# EAGLE design phmeter (EAGLE 8.4.3)
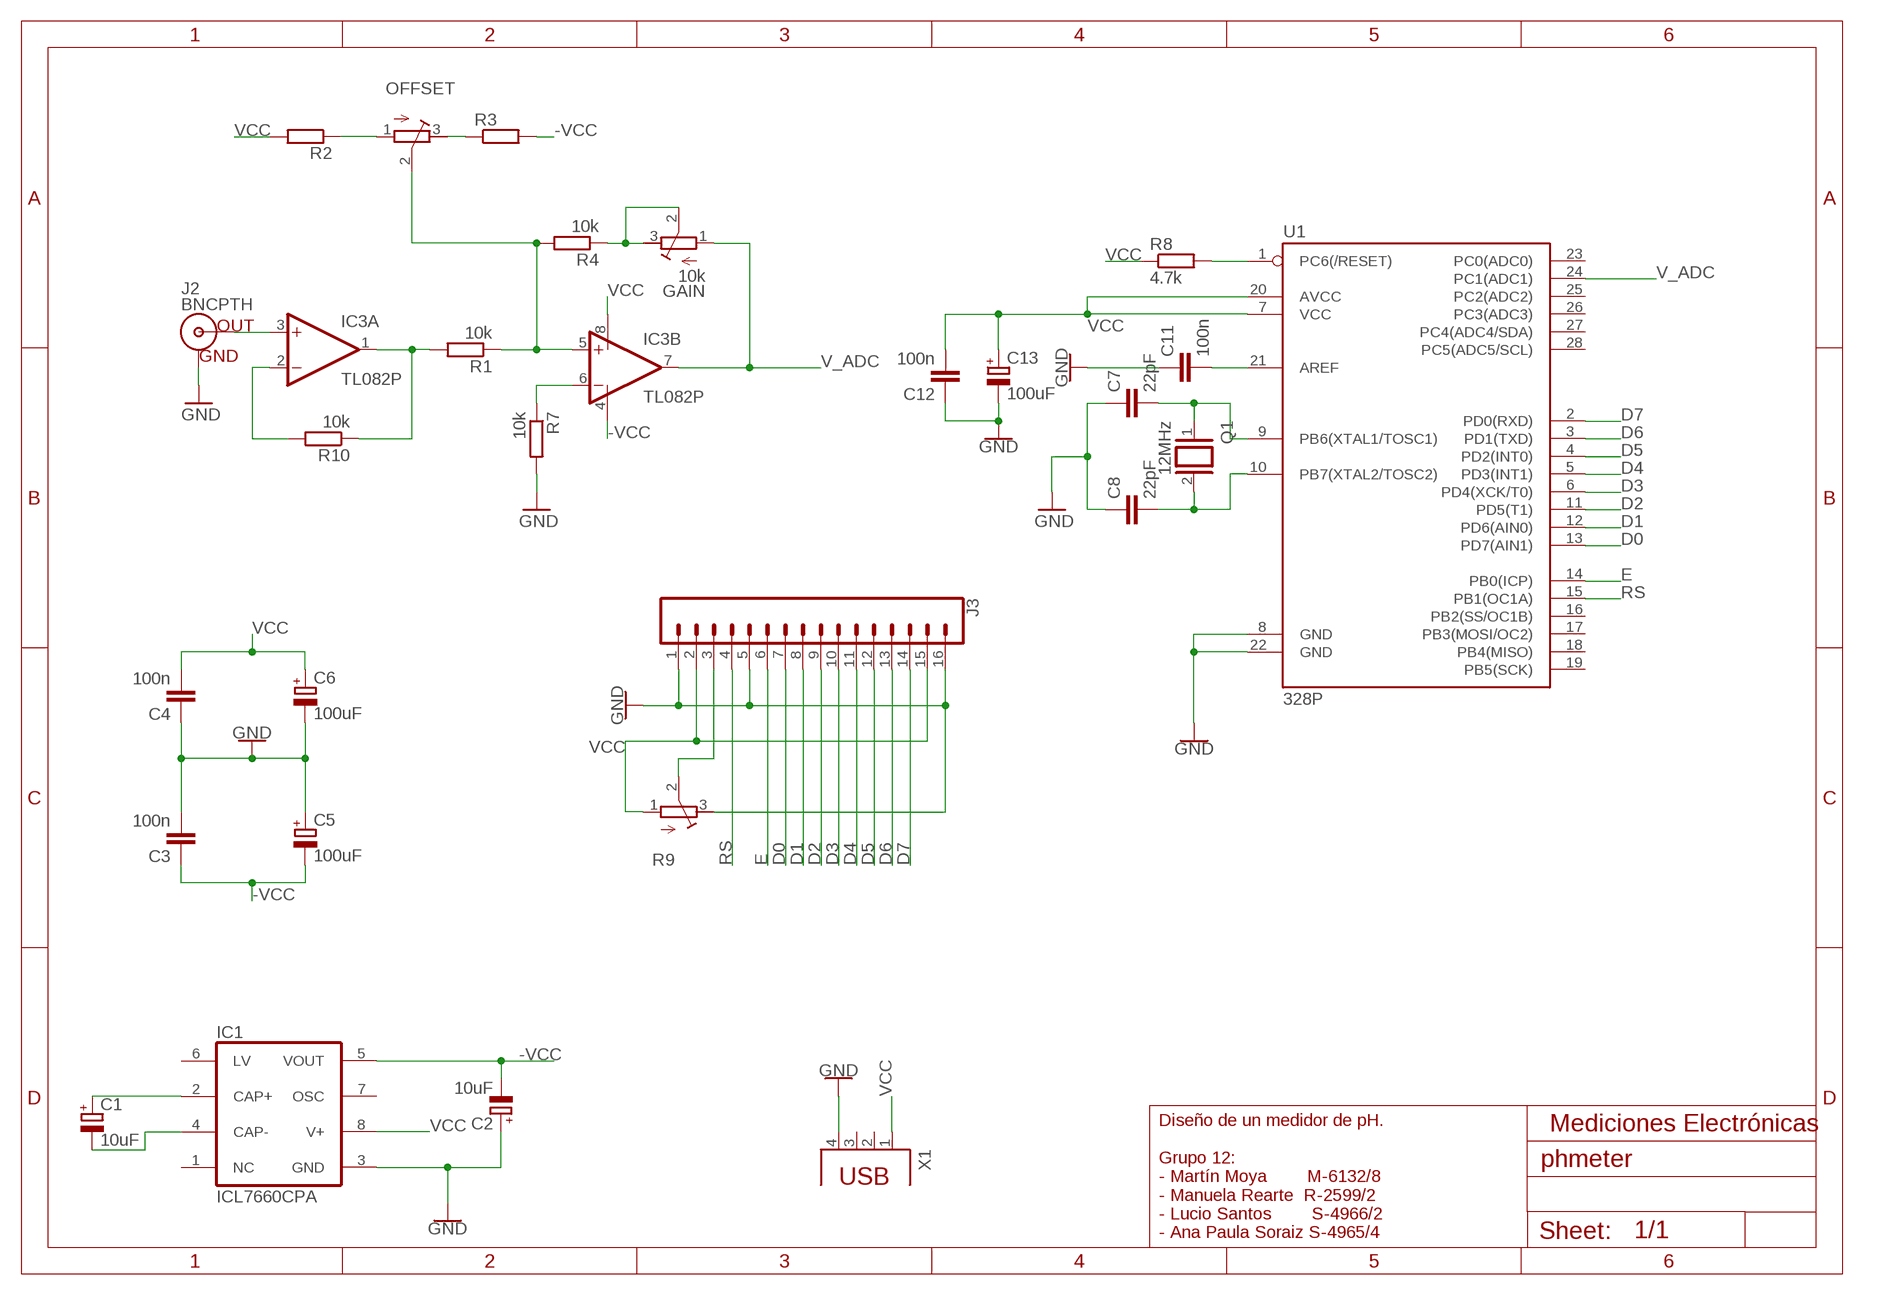
[diagram p0: schematic, sheet 1]

## Parts
C1  10uF  CPOL-EUE1.8-4  [E1,8-4]
C2  10uF  CPOL-EUE1.8-4  [E1,8-4]
C3  100n  C-EU025-024X044  [C025-024X044]
C4  100n  C-EU025-024X044  [C025-024X044]
C5  100uF  CPOL-EUE1.8-4  [E1,8-4]
C6  100uF  CPOL-EUE1.8-4  [E1,8-4]
C7  22pF  C-EU025-024X044  [C025-024X044]
C8  22pF  C-EU025-024X044  [C025-024X044]
C11  100n  C-EU025-024X044  [C025-024X044]
C12  100n  C-EU025-024X044  [C025-024X044]
C13  100uF  CPOL-EUE1.8-4  [E1,8-4]
GAIN  10k  R-TRIMM64W  [RTRIM64W]
IC1  ICL7660CPA  [DIL08]
IC3  TL082P  [DIL08]
J2  BNCPTH  [BNC]
J3  CONN_16  [1X16]
OFFSET  R-TRIMM64W  [RTRIM64W]
Q1  12MHz  XTAL/S  [QS]
R1  10k  R-EU_0207/10  [0207/10]
R2  R-EU_0207/10  [0207/10]
R3  R-EU_0207/10  [0207/10]
R4  10k  R-EU_0207/10  [0207/10]
R7  10k  R-EU_0207/10  [0207/10]
R8  4.7k  R-EU_0207/10  [0207/10]
R9  R-TRIMM64W  [RTRIM64W]
R10  10k  R-EU_0207/10  [0207/10]
U1  328P  ATMEGA328P_PDIP  [DIP28]
X1  PN61729  [PN61729]

## Nets
-VCC: C2.- C3.1 C5.- IC1.5(VOUT) IC3.4(P:V-) R3.2
D0: J3.7 U1.13(PD7(AIN1))
D1: J3.8 U1.12(PD6(AIN0))
D2: J3.9 U1.11(PD5(T1))
D3: J3.10 U1.6(PD4(XCK/T0))
D4: J3.11 U1.5(PD3(INT1))
D5: J3.12 U1.4(PD2(INT0))
D6: J3.13 U1.3(PD1(TXD))
D7: J3.14 U1.2(PD0(RXD))
E: J3.6 U1.14(PB0(ICP))
GND: C2.+ C3.2 C4.1 C5.+ C6.- C7.1 C8.1 C11.1 C12.1 C13.- IC1.3(GND) J2.GND J3.1 J3.5 J3.16 R7.2 R9.3(E) U1.8(GND) U1.22(GND) X1.4
N$1: IC3.1(A:OUT) R1.2 R10.1
N$2: C1.+ IC1.2(CAP+)
N$3: GAIN.2(S) GAIN.3(E) R4.1
N$4: IC3.6(B:-IN) R7.1
N$5: C1.- IC1.4(CAP-)
N$6: OFFSET.3(E) R3.1
N$7: OFFSET.1(A) R2.1
N$8: C7.2 Q1.1 U1.9(PB6(XTAL1/TOSC1))
N$9: C8.2 Q1.2 U1.10(PB7(XTAL2/TOSC2))
N$10: J3.3 R9.2(S)
N$11: C11.2 U1.21(AREF)
N$12: R8.2 U1.1(PC6(/RESET))
N$22: IC3.3(A:+IN) J2.S(OUT)
N$23: IC3.2(A:-IN) R10.2
RS: J3.4 U1.15(PB1(OC1A))
V_ADC: GAIN.1(A) IC3.7(B:OUT) U1.24(PC1(ADC1))
V_OFFSET: IC3.5(B:+IN) OFFSET.2(S) R1.1 R4.2
VCC: C4.2 C6.+ C12.2 C13.+ IC1.8(V+) IC3.8(P:V+) J3.2 J3.15 R2.2 R8.1 R9.1(A) U1.7(VCC) U1.20(AVCC) X1.1
Unconnected: IC1.1(NC) IC1.6(LV) IC1.7(OSC) U1.16(PB2(SS/OC1B)) U1.17(PB3(MOSI/OC2)) U1.18(PB4(MISO)) U1.19(PB5(SCK)) U1.23(PC0(ADC0)) U1.25(PC2(ADC2)) U1.26(PC3(ADC3)) U1.27(PC4(ADC4/SDA)) U1.28(PC5(ADC5/SCL)) X1.2 X1.3

## Notes on the sheet
- Mediciones Electrónicas
- Diseño de un medidor de pH.
  
  Grupo 12:
  - Martín Moya        M-6132/8
  - Manuela Rearte  R-2599/2
  - Lucio Santos        S-4966/2
  - Ana Paula Soraiz S-4965/4

## Library data of the parts
C1 C2 C5 C6 C13 = rcl:CPOL-EU: POLARIZED CAPACITOR, European symbol
C3 C4 C7 C8 C11 C12 = resistor:C-EU: CAPACITOR, European symbol
GAIN OFFSET R9 = rcl:R-TRIMM: Trimm resistor
IC1 = maxim:ICL7660CPA: VOLTAGE CONVERTER; MF: INTERSIL; MPN: ICL7660CPA; OC_FARNELL: 1018170; OC_NEWARK: 06F7441
IC3 = linear:TL082: OP AMP Data sheet <http://www.ti.com/lit/ds/symlink/tl084a . pdf>; DATA_SHEET: <a href="http://www.ti.com/lit/ds/symlink/tl084a.pdf"> Data sheet </a>
J2 = SparkFun-Connectors:BNC: BNC Right Angle Connector Mouser Part# 5227161 SparkFun Products: BNC Connector - Right Angle <https://www.sparkfun.com/products/10550>; PROD_ID: LPA-12729; SF_ID: PRT-10550
J3 = SparkFun-Connectors:CONN_16: Multi connection point. Often used as Generic Header-pin footprint for 0.1 inch spaced/style header connections On any of the 0.1 inch spaced packages, you can populate with these: Break Away Headers - Straight <https://www.sparkfun.com/products/116> (PRT-00116) Break Away Male Headers - Right Angle <https://www.sparkfun.com/products/553> (PRT-00553) Female Headers <https://www.sparkfun.com/products/115> (PRT-00115) Break Away Headers - Machine Pin <https://www.sparkfun.com/products/117> (PRT-00117) Break Away Female Headers - Swiss Machine Pin <https://www.sparkfun.com/products/743> (PRT-00743) For SCREWTERMINALS and SPRING TERMINALS visit here: Screw Terimnals on SparkFun.com <https://www.sparkfun.com/search/results?term=Screw+Terminals> (5mm/3.5mm/2.54mm spacing) This device is also useful as a general connection point to wire up your design to another part of your project. Our various solder wires solder well into these plated through hole pads. Hook-Up Wire - Assortment (Stranded, 22 AWG) <https://www.sparkfun.com/products/11375> (PRT-11375) Hook-Up Wire - Assortment (Solid Core, 22 AWG) <https://www.sparkfun.com/products/11367> (PRT-11367) View the entire wire category on our website here <https://www.sparkfun.com/categories/141> Special notes: Molex polarized connector foot print use with SKU : PRT-08231 with associated crimp pins and housings. 1MM SMD Version SKU: PRT-10208 NOTES ON THE VARIANTS LOCK and LOCK_LONGPADS... This footprint was designed to help hold the alignment of a through-hole component (i.e. 6-pin header) while soldering it into place. You may notice that each hole has been shifted either up or down by 0.005 of an inch from it's more standard position (which is a perfectly straight line). This slight alteration caused the pins (the squares in the middle) to touch the edges of the holes. Because they are alternating, it causes a "brace" to hold the component in place. 0.005 has proven to be the perfect amount of "off-center" position when using our standard breakaway headers. Although looks a little odd when you look at the bare footprint, once you have a header in there, the alteration is very hard to notice. Also,if you push a header all the way into place, it is covered up entirely on the bottom side.
Q1 = special:XTAL/S: CRYSTAL
R1-R4 R7 R8 R10 = rcl:R-EU_: RESISTOR, European symbol
U1 = SparkFun-IC-Microcontroller:ATMEGA328P_PDIP: Atmel 328P Through hole ATMEGA328P uC used in the Arduino 32kb flash, 1k EEPROM, 2k SRAM Datasheet <http://www.sparkfun.com/datasheets/Components/SMD/ATMega328.pdf> SparkFun Products Storefront component: AVR 28 Pin 20MHz 32K 6A/D - ATMega328P <https://www.sparkfun.com/products/9061> (COM-09061) SparkFun Simon Says - Through-Hole Soldering Kit <https://www.sparkfun.com/products/10547> (KIT-10547) SparkFun Learn to Solder - Simon Says <https://www.sparkfun.com/products/13708> (KIT-13708) SparkFun BigTime Watch Kit <https://www.sparkfun.com/products/11734> (KIT-11734) SparkFun ClockIt <https://www.sparkfun.com/products/10930> (KIT-10930) SparkFun Serial Enabled LCD Kit <https://www.sparkfun.com/products/10097> (LCD-10097) SparkFun Simon Tilts - Through Hole Soldering Kit <https://www.sparkfun.com/products/12634> (KIT-12634) SparkFun Frequency Counter Kit <https://www.sparkfun.com/products/10140> (KIT-10140) FabFM Radio Kit <https://www.sparkfun.com/products/11043> (KIT-11043) SparkFun Binary Blaster Kit <https://www.sparkfun.com/products/12037> (KIT-12037) SparkFun Metro-Gnome <https://www.sparkfun.com/products/9236> (KIT-09236) ATmega328 with Arduino Optiboot (Uno) <https://www.sparkfun.com/products/10524> (DEV-10524); PROD_ID: IC-09136
X1 = con-berg:PN61729: BERG USB connector; OC_FARNELL: unknown; OC_NEWARK: unknown

## Module -VC
Ports: 

### Library data of the parts

## Board
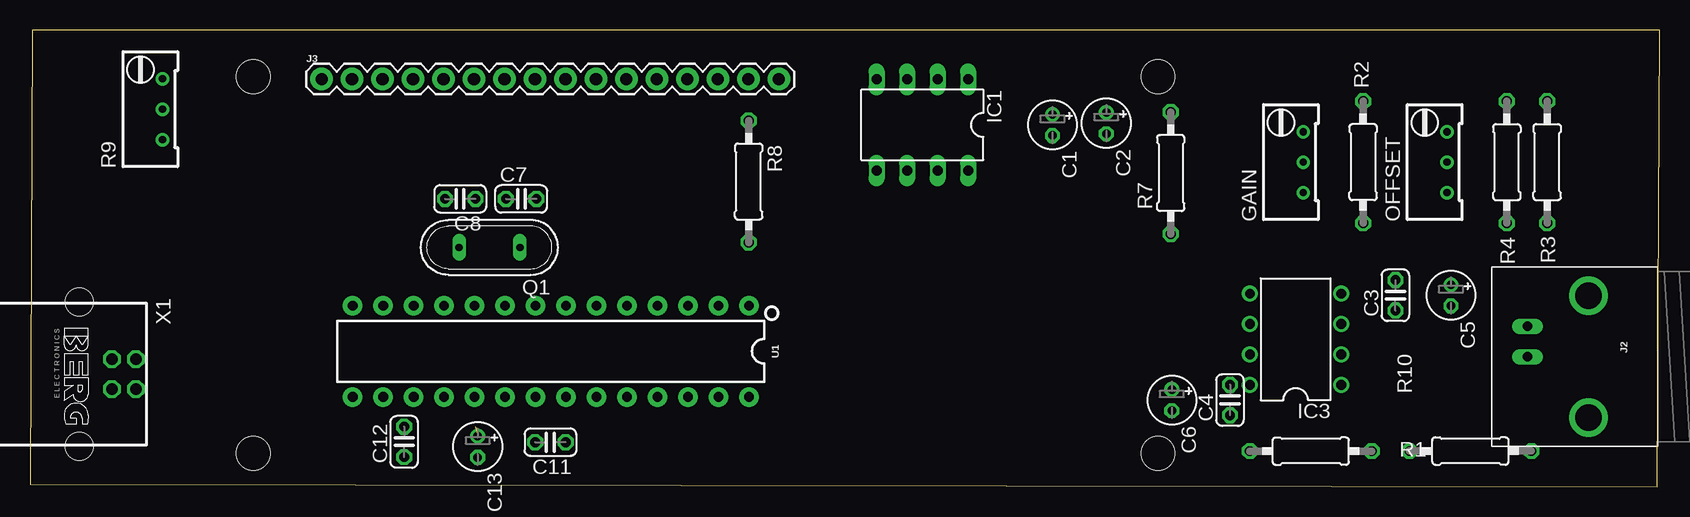
[diagram p1: board, top side]
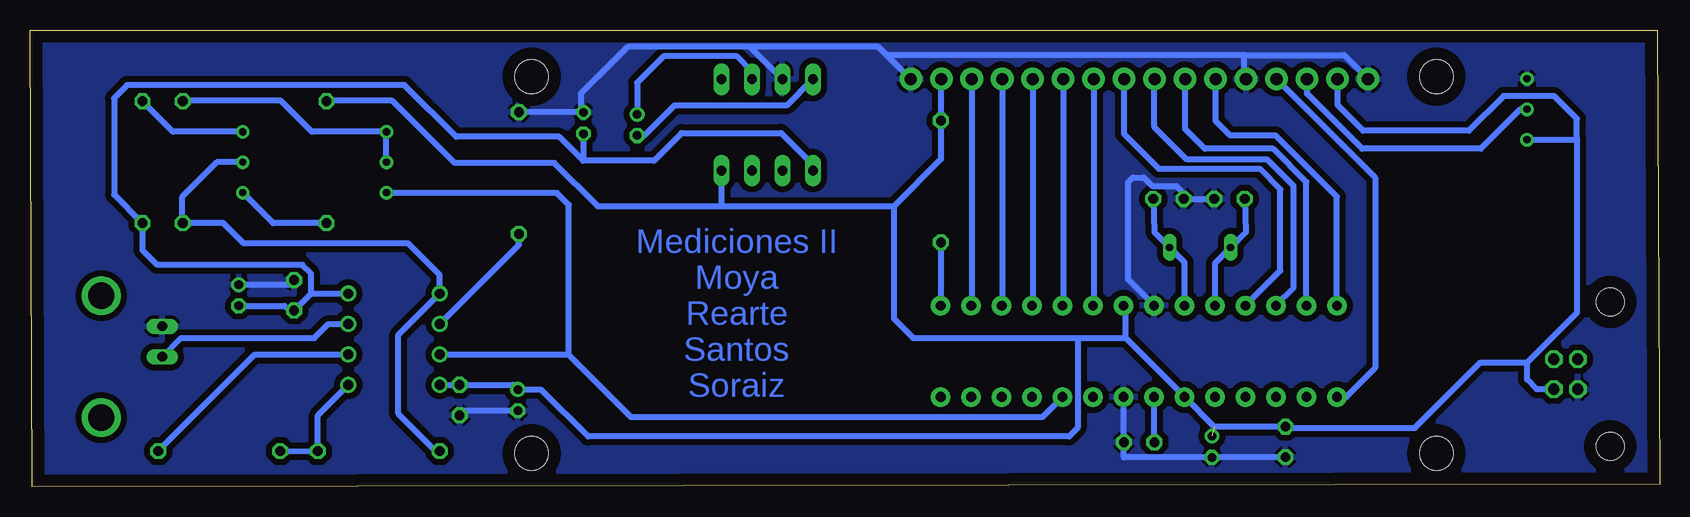
[diagram p2: board, bottom side, seen from below]

Size 135.8 x 38.1 mm. Coordinates in mm from the lower left corner, seen from the top.
Outline: 0,0.2 135.6,0 135.8,38.1 0.2,38.1 0,0.2
Copper layers (1*16): Top 0.035mm / dielectric 2mm / Bottom 0.035mm
Design rules "default *": minimum track width 6mil, minimum drill 0.35mm, track to track 6mil, track to pad 6mil, pad to pad 6mil, via to via 6mil, smd to smd 6mil, copper to edge 40mil, drill to drill 6mil, minimum pad ring 10mil, minimum via ring 8mil, stop-mask expansion 4mil, vias tented up to drill 0mil, thermal gap 10mil
Holes 2.8 mm at 18.6,34.2 94,34.2 18.6,2.8 94,2.8

### Footprints (pad centres in the part's own frame; a part is rotated, then mirrored left to right if it is on the bottom)
E1,8-4 = drill 0.711 pad 1.168: + -0.889,0 | drill 0.711 pad 1.168 octagon: - 0.889,0
C025-024X044 = drill 0.813 octagon: 1 -1.27,0; 2 1.27,0
RTRIM64W = drill 0.61: 1 1.27,-2.54; 2 1.27,0; 3 1.27,2.54
DIL08 = drill 0.813 long: 1 -3.81,-3.81; 2 -1.27,-3.81; 3 1.27,-3.81; 4 3.81,-3.81; 5 3.81,3.81; 6 1.27,3.81; 7 -1.27,3.81; 8 -3.81,3.81
DIL08' = drill 0.813 pad 1.27: 1 -3.81,-3.81; 2 -1.27,-3.81; 3 1.27,-3.81; 4 3.81,-3.81; 5 3.81,3.81; 6 1.27,3.81; 7 -1.27,3.81; 8 -3.81,3.81
BNC = drill 2.2: 3 -5.08,5.08; 4 5.08,5.08 | drill 0.8 long: GND -2.54,0; S 0,0
1X16 = drill 1.016 pad 1.88: 1 0,0; 2 2.54,0; 3 5.08,0; 4 7.62,0; 5 10.16,0; 6 12.7,0; 7 15.24,0; 8 17.78,0; 9 20.32,0; 10 22.86,0; 11 25.4,0; 12 27.94,0; 13 30.48,0; 14 33.02,0; 15 35.56,0; 16 38.1,0
QS = drill 0.61 long: 1 -2.54,0; 2 2.54,0
0207/10 = drill 0.813 octagon: 1 -5.08,0; 2 5.08,0
DIP28 = drill 0.813 pad 1.626: 1 -16.51,-3.81; 2 -13.97,-3.81; 3 -11.43,-3.81; 4 -8.89,-3.81; 5 -6.35,-3.81; 6 -3.81,-3.81; 7 -1.27,-3.81; 8 1.27,-3.81; 9 3.81,-3.81; 10 6.35,-3.81; 11 8.89,-3.81; 12 11.43,-3.81; 13 13.97,-3.81; 14 16.51,-3.81; 15 16.51,3.81; 16 13.97,3.81; 17 11.43,3.81; 18 8.89,3.81; 19 6.35,3.81; 20 3.81,3.81; 21 1.27,3.81; 22 -1.27,3.81; 23 -3.81,3.81; 24 -6.35,3.81; 25 -8.89,3.81; 26 -11.43,3.81; 27 -13.97,3.81; 28 -16.51,3.81
PN61729 = drill 0.95 octagon: 1 1.25,4.71; 2 -1.25,4.71; 3 -1.25,2.71; 4 1.25,2.71 | hole 2.3: -6.02,0; 6.02,0

### Placement (x,y rotation side)
C1  85.2,30.18 270 top
C2  89.69,30.33 270 top
C3  113.79,15.97 90 top
C4  100,7.23 90 top
C5  118.41,15.97 270 top
C6  95.15,7.23 270 top
C7  40.93,24.01 0 top
C8  35.85,24.01 180 top
C11  43.37,3.71 180 top
C12  31.18,3.74 90 top
C13  37.31,3.34 270 top
GAIN  104.83,27.07 0 top
IC1  74.37,30.18 180 top
IC3  TL082P  [DIL08']  105.47,12.3 90 top
J2  124.78,10.85 270 top
J3  24.3,34 0 top
OFFSET  116.8,27.07 0 top
Q1  38.29,19.96 180 top
R1  106.73,2.97 0 top
R2  111.1,27.07 90 top
R3  126.43,27.07 270 top
R4  123.07,27.07 270 top
R7  95.06,26.17 90 top
R8  59.89,25.46 270 top
R9  9.78,31.49 0 top
R10  120.03,2.98 0 top
U1  43.4,11.3 180 top
X1  4.11,9.39 270 top

### Tracks (layer width: path | path; a pad name or v marks a point on that pad's centre or on a via)
-VCC
  Bottom 0.508: C5.- 118.39,15.1 114.6,15.1 114.2,14.7 C3.1 | 89.7,27.2 83.8,27.2 81.5,29.5 73.2,29.5 70.56,26.86 IC1.5 | C2.- 89.7,27.2 | 113.7,14.61 C3.1 | 89.7,27.2 91.7,29.2 100.3,29.2 104.6,33.5 127.7,33.5 128.8,32.4 128.8,24.36 R3.2 126.43,19.73 125.2,18.5 113.1,18.5 112.38,17.78 112.38,16.11 | C3.1 112.38,16.11 | 112.38,16.11 IC3.4
D0
  Bottom 0.508: U1.13 29.43,25.43 32.2,28.2 37.9,28.2 39.54,29.84 J3.7
D1
  Bottom 0.508: U1.12 30.5,16.58 30.5,25.1 32.7,27.3 39.4,27.3 42.1,30 42.1,33.98 J3.8
D2
  Bottom 0.508: U1.11 31.6,18.02 31.6,24.8 33.3,26.5 41.7,26.5 44.62,29.42 J3.9
D3
  Bottom 0.508: J3.10 47.16,15.16 U1.6
D4
  Bottom 0.508: J3.11 49.7,15.16 U1.5
D5
  Bottom 0.508: J3.12 52.24,15.16 U1.4
D6
  Bottom 0.508: J3.13 54.78,15.16 U1.3
D7
  Bottom 0.508: J3.14 57.32,15.16 U1.2
E
  Bottom 0.508: U1.14 26.89,24.19 32,29.3 35.8,29.3 37,30.5 J3.6
GND
  Bottom 0.508: C8.1 C7.1 39.66,24.46 40.3,25.1 42.3,25.1 43,25.8 43.9,25.8 44.3,25.4 44.3,17.28 U1.8 | C12.1 37.29,2.47 C13.- | C13.- 37.36,2.4 | C6.- 99.62,6.34 C4.1 | C2.+ 89.72,31.25 89.9,31.25 | 89.9,31.25 R7.2 | IC1.3 75.81,36.7 | 75.81,36.7 86,36.7 89.9,32.8 89.9,31.25 | 64.4,36 J3.16 | 64.4,36 65.1,36.7 75.81,36.7 | J3.1 26.3,36 34.6,36 | 34.6,36 64.4,36 | J3.5 34.6,34.14 34.6,36 | C5.+ 114.17,16.86 C3.2 | C13.- 44.64,2.45 C11.1 44.64,7.49 U1.22
  pour Bottom (isolate 0.5): -1.3,41 139.8,41.2 139.4,-4.9 -2.4,-4.6 -2,41.3
N$1
  Bottom 0.508: R10.1 R1.2 111.81,5.95 IC3.1
N$2
  Bottom 0.508: IC1.2 75.64,34.64 76.9,35.9 83,35.9 85.2,33.7 C1.+
N$3
  Bottom 0.508: GAIN.2 GAIN.3 112.31,29.61 114.9,32.2 123.02,32.2 R4.1
N$4
  Bottom 0.508: IC3.6 95.06,20.17 R7.1
N$5
  Bottom 0.508: IC1.4 72.75,31.8 82.1,31.8 84.61,29.29 C1.-
N$6
  Bottom 0.508: OFFSET.3 123.89,29.61 R3.1
N$7
  Bottom 0.508: R2.1 115.53,21.99 OFFSET.1
N$8
  Bottom 0.508: C7.2 42.1,21.23 Q1.1 39.59,18.72 U1.9
N$9
  Bottom 0.508: C8.2 34.48,21.23 Q1.2 37.05,18.66 U1.10
N$10
  Bottom 0.508: 11.05,31.45 R9.2 11.61,31.49 14.9,28.2 24.8,28.2 29.38,32.78 J3.3
N$11
  Bottom 0.508: C11.2 42.1,7.46 U1.21
N$12
  Bottom 0.508: U1.1 59.91,20.36 R8.2
N$22
  Bottom 0.508: IC3.3 110.93,13.57 112.1,12.4 123.23,12.4 J2.S
N$23
  Bottom 0.508: R10.2 117.06,11.03 IC3.2
RS
  Bottom 0.508: J3.4 23.7,25.78 23.7,9.9 26.11,7.49 U1.15
V_ADC
  Bottom 0.508: 90.9,11 101.63,11 IC3.7 | GAIN.1 106.07,24.5 91.9,24.5 90.9,23.5 90.9,11 | U1.24 51.44,5.8 85.7,5.8 90.9,11
V_OFFSET
  Bottom 0.508: OFFSET.2 120.23,27.07 123.1,24.2 123.1,22.03 | 123.1,22.03 R4.2 | R1.1 101.97,2.97 105.1,6.1 105.1,12.67 IC3.5 101.66,17.66 104.3,20.3 118,20.3 119.7,22 122.8,22 123.1,21.7 123.1,22.03
VCC  (1 unrouted)
  Bottom 0.508: 11.04,10.36 11.05,10.37 | 11.04,10.36 14.94,10.36 20.4,4.9 31.07,4.9 C12.2 37.11,5.01 U1.20 44.5,12.4 | J3.15 59.89,33.97 R8.1 59.89,27.31 63.8,23.4 | IC3.8 101.65,8.5 C4.2 95.53,8.5 C6.+ 95.13,8.1 93.2,8.1 89.3,4.2 49.2,4.2 48.5,4.9 48.5,12.3 48.6,12.4 | J3.2 26.84,31.84 24.7,29.7 15.9,29.7 13,32.6 8.8,32.6 6.9,30.7 6.9,29.1 | 78.2,26.35 IC1.8 78.18,23.58 78,23.4 | 78,23.4 63.8,23.4 | 78,23.4 88.5,23.4 92.1,27 100.4,27 105.6,32.2 111.05,32.2 R2.2 | U1.7 44.5,14.94 44.5,12.4 | 11.04,10.36 6.9,14.5 6.9,29.1 | X1.1 10.24,8.14 11.04,8.94 11.04,10.36 | R9.1 7.05,28.95 6.9,29.1 | 63.8,23.4 63.8,14 62.2,12.4 48.6,12.4 | 48.6,12.4 44.5,12.4

### Text on the board
Bottom: Mediciones II / Moya / Rearte / Santos / Soraiz